# EAGLE design rpi-receiver (EAGLE 6.2)
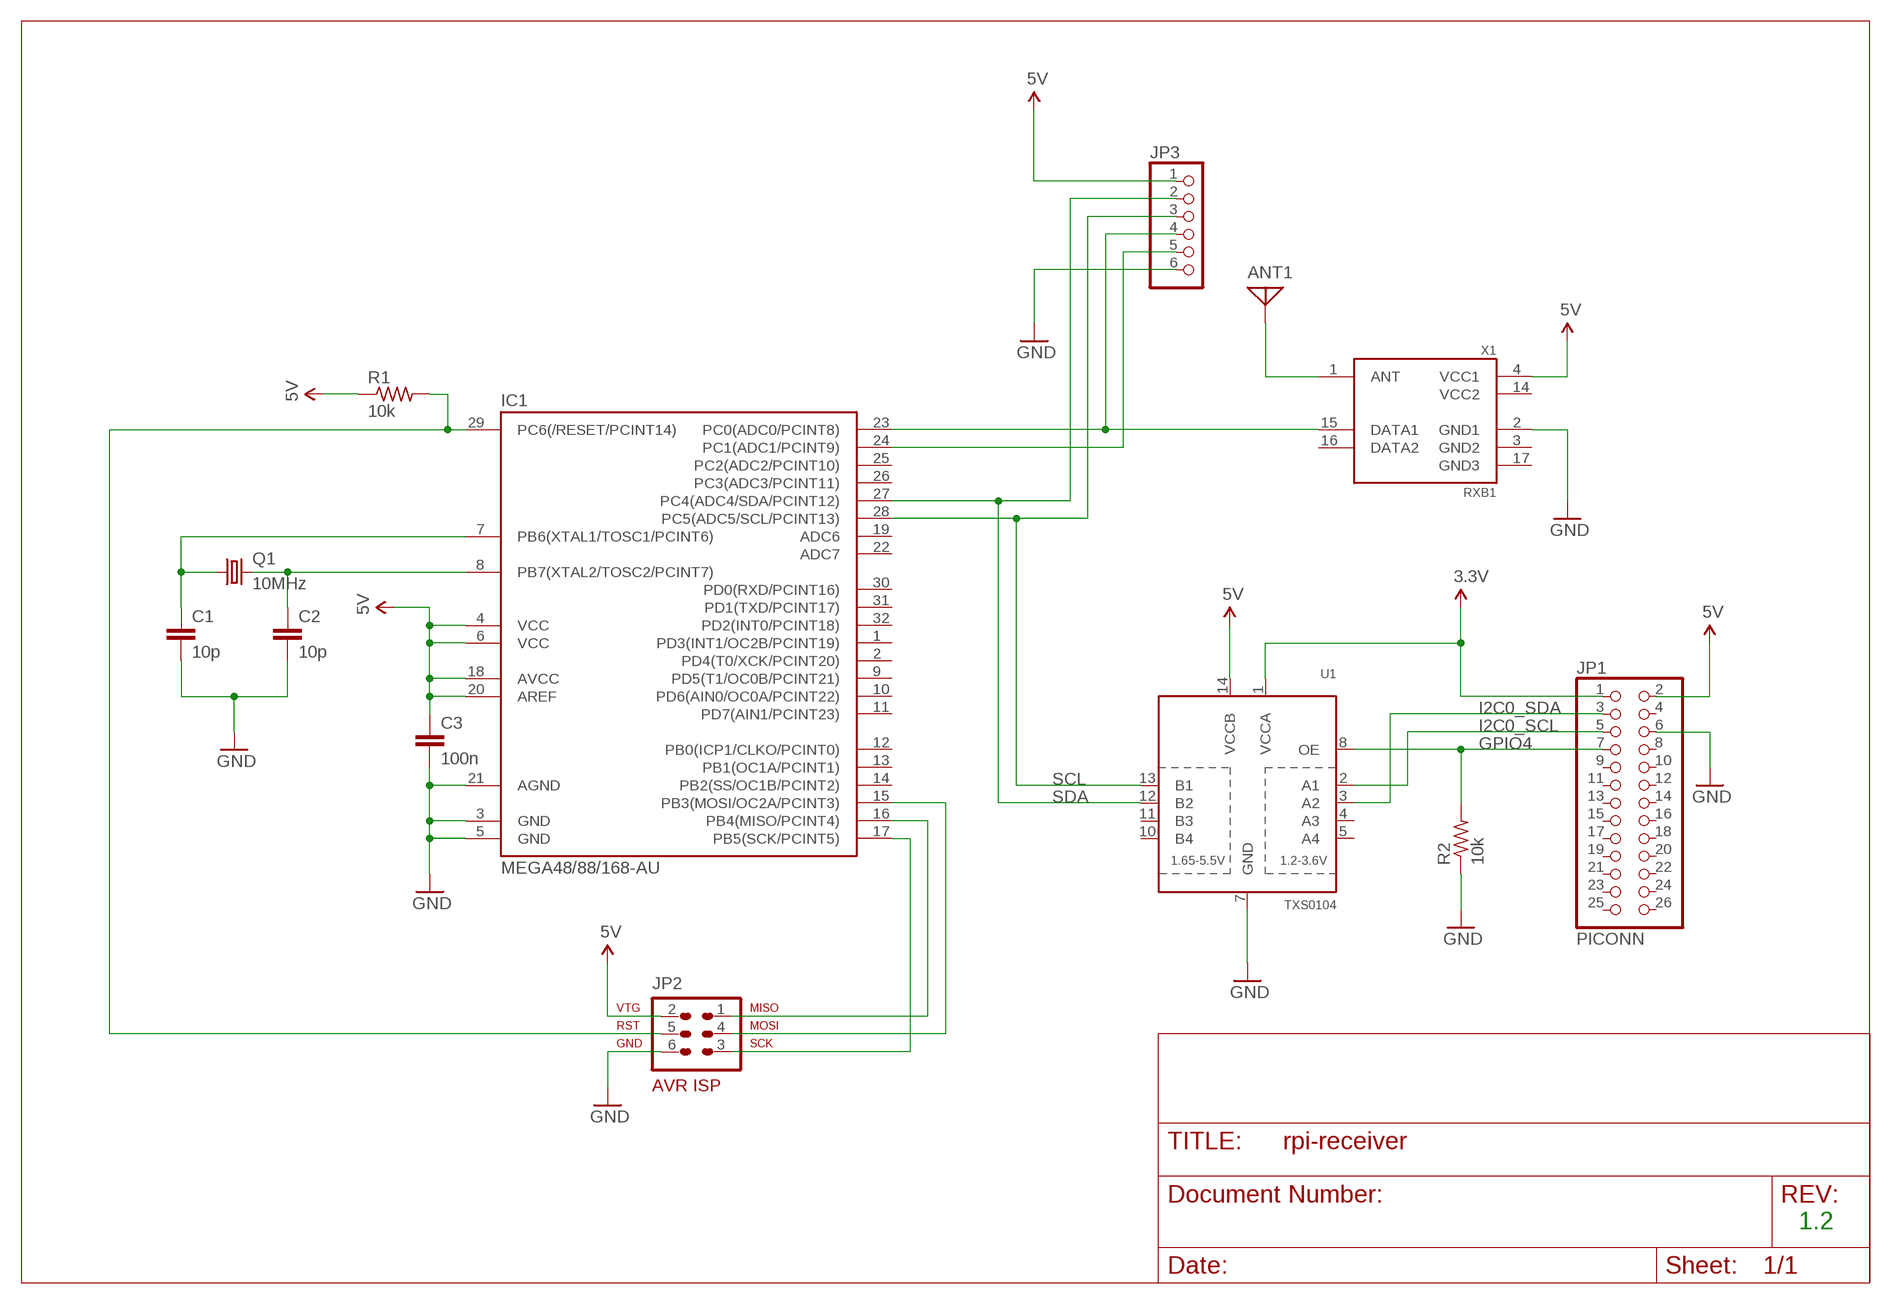
[diagram p0: schematic, sheet 1]

## Parts
ANT1  ANTENNA  [PAD-01]
C1  10p  C-EUC0805  [C0805]
C2  10p  C-EUC0805  [C0805]
C3  100n  C-EUC0805  [C0805]
IC1  MEGA48/88/168-AU  [TQFP32-08]
JP1  PICONN  PINHD-2X13  [2X13]
JP2  AVR-ISP-6POL-HDR  [22-23-2061]
JP3  PINHD-1X6  [1X06]
Q1  10MHz  CRYSTALHC49UP  [HC49UP]
R1  10k  R-US_M0805  [M0805]
R2  10k  R-US_M0805  [M0805]
U1  TXS0104  TXB0104PWR  [TSSOP14]
X1  RXB1  [RXB1]

## Nets
3.3V: JP1.1 U1.1(VCCA)
5V: C3.1 IC1.4(VCC) IC1.6(VCC) IC1.18(AVCC) IC1.20(AREF) JP1.2 JP2.2 JP3.1 R1.1 U1.14(VCCB) X1.4(VCC1)
GND: C1.2 C2.2 C3.2 IC1.3(GND) IC1.5(GND) IC1.21(AGND) JP1.6 JP2.6 JP3.6 R2.1 U1.7(GND) X1.2(GND1)
GPIO4: JP1.7 R2.2 U1.8(OE)
I2C0_SCL: JP1.5 U1.2(A1)
I2C0_SDA: JP1.3 U1.3(A2)
N$1: C2.1 IC1.8(PB7(XTAL2/TOSC2/PCINT7)) Q1.2
N$2: C1.1 IC1.7(PB6(XTAL1/TOSC1/PCINT6)) Q1.1
N$3: IC1.16(PB4(MISO/PCINT4)) JP2.1
N$4: IC1.15(PB3(MOSI/OC2A/PCINT3)) JP2.4
N$6: ANT1.1 X1.1(ANT)
N$7: IC1.29(PC6(/RESET/PCINT14)) JP2.5 R1.2
N$10: IC1.17(PB5(SCK/PCINT5)) JP2.3
N$13: IC1.24(PC1(ADC1/PCINT9)) JP3.5
N$22: IC1.23(PC0(ADC0/PCINT8)) JP3.4 X1.15(DATA1)
SCL: IC1.28(PC5(ADC5/SCL/PCINT13)) JP3.3 U1.13(B1)
SDA: IC1.27(PC4(ADC4/SDA/PCINT12)) JP3.2 U1.12(B2)
Unconnected: IC1.1(PD3(INT1/OC2B/PCINT19)) IC1.2(PD4(T0/XCK/PCINT20)) IC1.9(PD5(T1/OC0B/PCINT21)) IC1.10(PD6(AIN0/OC0A/PCINT22)) IC1.11(PD7(AIN1/PCINT23)) IC1.12(PB0(ICP1/CLKO/PCINT0)) IC1.13(PB1(OC1A/PCINT1)) IC1.14(PB2(SS/OC1B/PCINT2)) IC1.19(ADC6) IC1.22(ADC7) IC1.25(PC2(ADC2/PCINT10)) IC1.26(PC3(ADC3/PCINT11)) IC1.30(PD0(RXD/PCINT16)) IC1.31(PD1(TXD/PCINT17)) IC1.32(PD2(INT0/PCINT18)) JP1.4 JP1.8 JP1.9 JP1.10 JP1.11 JP1.12 JP1.13 JP1.14 JP1.15 JP1.16 JP1.17 JP1.18 JP1.19 JP1.20 JP1.21 JP1.22 JP1.23 JP1.24 JP1.25 JP1.26 U1.4(A3) U1.5(A4) U1.10(B4) U1.11(B3) X1.16(DATA2)

## Notes on the sheet
- 1.2

## Power pins joined to a net without a drawn wire
GND2: X1.3(GND2)
GND3: X1.17(GND3)
VCC2: X1.14(VCC2)

## Library data of the parts
ANT1 = discrete:ANTENNA: Antenna
C1-C3 = rcl:C-EU: CAPACITOR, European symbol
IC1 = avr-4:MEGA48/88/168
JP1 = pinhead:PINHD-2X13: PIN HEADER
JP2 = avr-4:AVR-ISP-6: AVR ISP-6 Serial Programming Header
JP3 = adafruit:PINHD-1X6: PIN HEADER
Q1 = crystal:CRYSTAL: CRYSTAL; OC_FARNELL: unknown; OC_NEWARK: unknown
R1 R2 = rcl:R-US_: RESISTOR, American symbol
U1 = adafruit:TXB0104PWR: 4-Bit Bi-Directional Level Shifter 1.2V-3.6V (VCCA) to 1.65V-5.5V (VCCB) bi-directional level shifter with auto direction sensing. Max data rate - VCCA 1.8V: 20Mbps (50ns), VCCA 3.3V: 100Mbps (10ns) Digikey: 296-21929-1-ND
X1 = rolfe:RXB1: RXB1 433MHz receiver; Jaycar ZW-3102

## Board
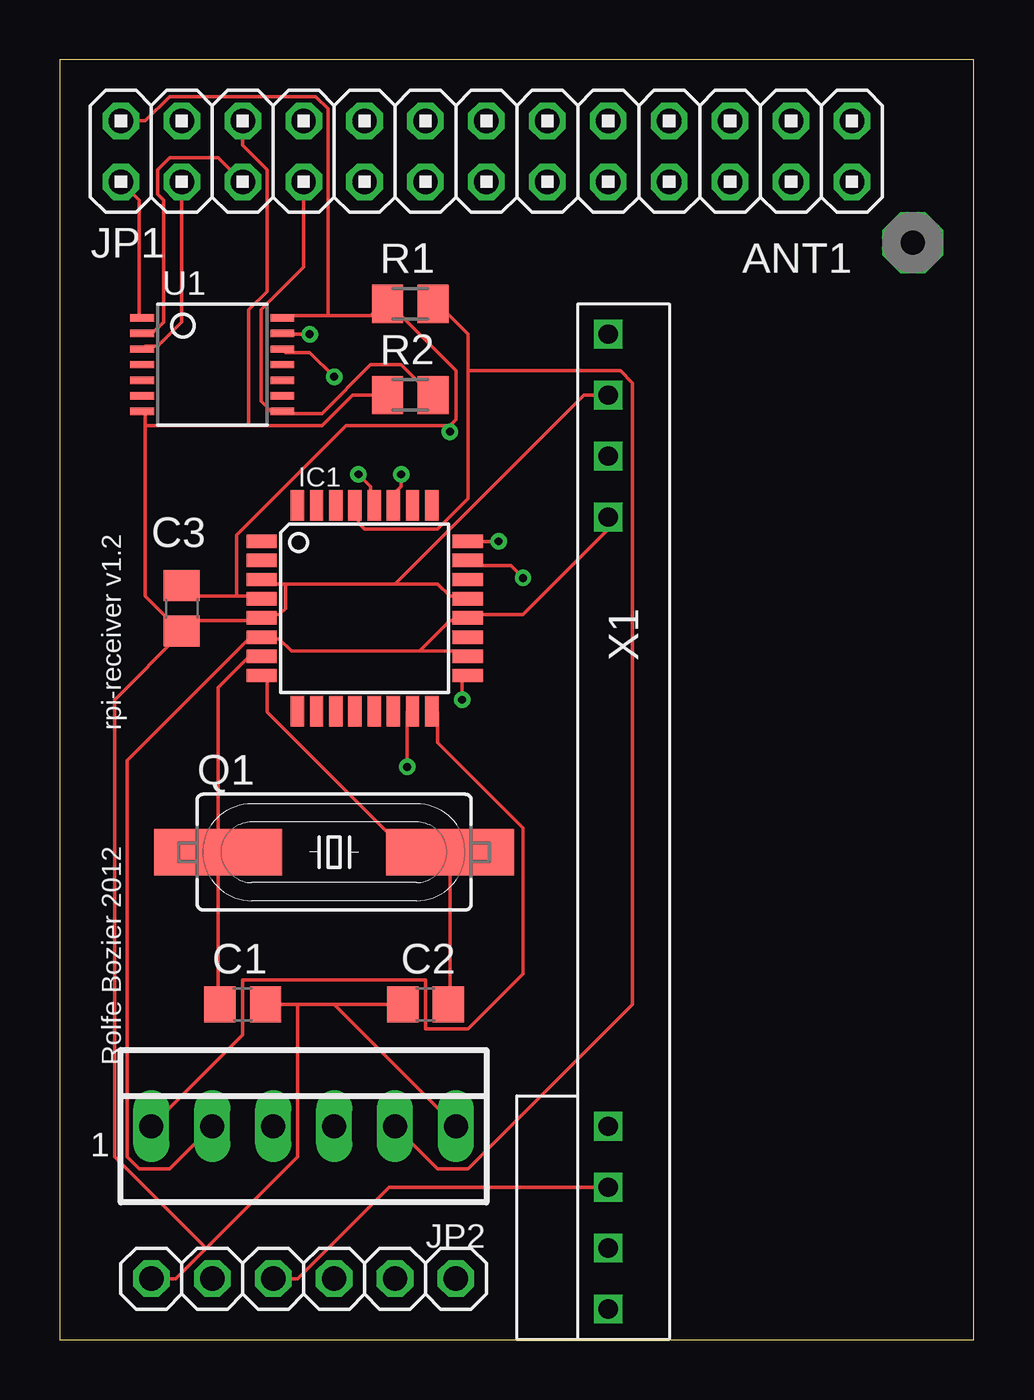
[diagram p1: board, top side]
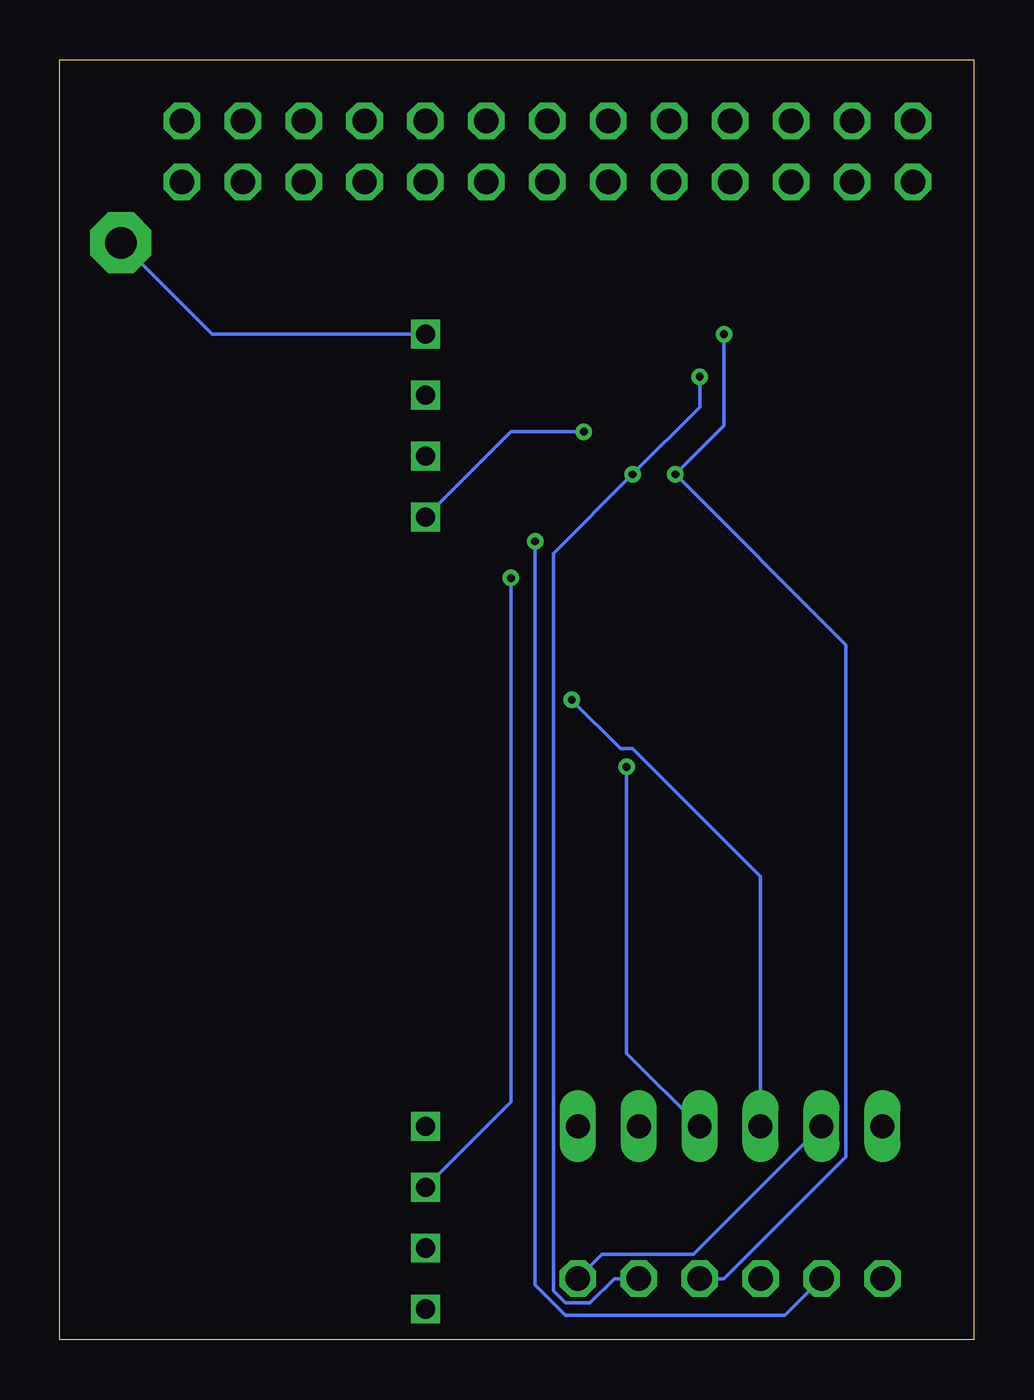
[diagram p2: board, bottom side, seen from below]

Size 38.1 x 53.34 mm. Coordinates in mm from the lower left corner, seen from the top.
Outline: 0,0 38.1,0 38.1,53.34 0,53.34 0,0
Copper layers (1*16): Top 0.0356mm / dielectric 1.5011mm / Bottom 0.0356mm
Design rules: minimum track width 6mil, minimum drill 13mil, track to track 6mil, track to pad 6mil, pad to pad 6mil, via to via 6mil, smd to smd 6mil, copper to edge 15mil, drill to drill 6mil, minimum pad ring 7mil, minimum via ring 7mil, stop-mask expansion 4mil, vias tented up to drill 0mil, thermal gap 10mil
tRestrict: area 25.4,0 to 38.1,43.2

### Footprints (pad centres in the part's own frame; a part is rotated, then mirrored left to right if it is on the bottom)
PAD-01 = drill 1.321 pad 2.54 octagon: 1 0,0
C0805 = smd 1.3 x 1.5: 1 -0.95,0; 2 0.95,0
TQFP32-08 = smd 1.27 x 0.559: 1 -4.293,2.8; 2 -4.293,2; 3 -4.293,1.2; 4 -4.293,0.4; 5 -4.293,-0.4; 6 -4.293,-1.2; 7 -4.293,-2; 8 -4.293,-2.8; 17 4.293,-2.8; 18 4.293,-2; 19 4.293,-1.2; 20 4.293,-0.4; 21 4.293,0.4; 22 4.293,1.2; 23 4.293,2; 24 4.293,2.8 | smd 0.559 x 1.27: 9 -2.8,-4.293; 10 -2,-4.293; 11 -1.2,-4.293; 12 -0.4,-4.293; 13 0.4,-4.293; 14 1.2,-4.293; 15 2,-4.293; 16 2.8,-4.293; 25 2.8,4.293; 26 2,4.293; 27 1.2,4.293; 28 0.4,4.293; 29 -0.4,4.293; 30 -1.2,4.293; 31 -2,4.293; 32 -2.8,4.293
2X13 = drill 1.016 octagon: 1 -15.24,-1.27; 2 -15.24,1.27; 3 -12.7,-1.27; 4 -12.7,1.27; 5 -10.16,-1.27; 6 -10.16,1.27; 7 -7.62,-1.27; 8 -7.62,1.27; 9 -5.08,-1.27; 10 -5.08,1.27; 11 -2.54,-1.27; 12 -2.54,1.27; 13 0,-1.27; 14 0,1.27; 15 2.54,-1.27; 16 2.54,1.27; 17 5.08,-1.27; 18 5.08,1.27; 19 7.62,-1.27; 20 7.62,1.27; 21 10.16,-1.27; 22 10.16,1.27; 23 12.7,-1.27; 24 12.7,1.27; 25 15.24,-1.27; 26 15.24,1.27
22-23-2061 = drill 1 long: 1 -6.35,0; 2 -3.81,0; 3 -1.27,0; 4 1.27,0; 5 3.81,0; 6 6.35,0
1X06 = drill 1.016 octagon: 1 -6.35,0; 2 -3.81,0; 3 -1.27,0; 4 1.27,0; 5 3.81,0; 6 6.35,0
HC49UP = smd 5.334 x 1.93: 1 -4.826,0; 2 4.826,0
M0805 = smd 1.3 x 1.6: 1 -0.95,0; 2 0.95,0
TSSOP14 = smd 0.305 x 0.991: 1 -1.95,-2.918; 2 -1.3,-2.918; 3 -0.65,-2.918; 4 0,-2.918; 5 0.65,-2.918; 6 1.3,-2.918; 7 1.95,-2.918; 8 1.95,2.918; 9 1.3,2.918; 10 0.65,2.918; 11 0,2.918; 12 -0.65,2.918; 13 -1.3,2.918; 14 -1.95,2.918
RXB1 = drill 0.8 square: 1 -20.32,0; 2 -17.78,0; 3 -15.24,0; 4 -12.7,0; 14 12.7,0; 15 15.24,0; 16 17.78,0; 17 20.32,0

### Placement (x,y rotation side)
ANT1  35.56,45.72 180 top
C1  7.62,13.97 0 top
C2  15.24,13.97 180 top
C3  5.08,30.48 270 top
IC1  12.7,30.48 0 top
JP1  17.78,49.53 0 top
JP2  10.16,8.89 0 top
JP3  10.16,2.54 180 top
Q1  11.43,20.32 0 top
R1  14.61,43.18 0 top
R2  14.61,39.37 0 top
U1  6.35,40.64 270 top
X1  22.86,21.59 270 top

### Tracks (layer width: path | path; a pad name or v marks a point on that pad's centre or on a via)
3.3V
  Top 0.152: JP1.1 3.3,47.5 3.3,42.67 U1.1
5V  (via drill 0.33)
  Top 0.152: 7.37,30.99 5.33,30.99 5.08,31.24 C3.1 | 7.37,30.99 8.38,30.99 IC1.4 | 11.18,42.67 12.95,42.67 13.46,43.18 R1.1 13.72,43.18 16.51,40.39 16.51,38.35 16.26,38.1 | 11.18,42.67 9.4,42.67 U1.14 | 7.37,30.99 7.37,33.53 11.94,38.1 16.26,38.1 | JP1.2 3.56,50.8 4.57,51.82 10.67,51.82 11.18,51.31 11.18,42.67 | 14.99,28.7 9.65,28.7 9.14,29.21 8.64,29.21 IC1.6 8.38,29.21 7.87,29.21 2.79,24.13 2.79,7.62 3.3,7.11 4.57,7.11 JP2.2 | 14.99,28.7 16.76,28.7 IC1.18 | 14.99,28.7 16.26,29.97 16.76,29.97 IC1.20 17.02,30.23 19.3,30.23 22.86,33.78 X1.4 | v16.26,37.85 16.26,38.1
  Bottom 0.152: JP2.2 11.68,3.56 15.49,3.56 JP3.1 | v16.26,37.85 19.3,37.85 X1.4
GND
  Top 0.152: C2.2 11.43,13.97 | 11.43,13.97 9.91,13.97 | 9.91,13.97 C1.2 | 11.43,13.97 JP2.6 | JP3.6 4.83,2.54 6.1,3.81 | 6.1,3.81 9.91,7.62 9.91,13.97 | 13.97,31.5 15.75,31.5 16.26,30.99 16.76,30.99 IC1.21 | 13.97,31.5 9.4,31.5 | 9.4,31.5 8.64,31.5 IC1.3 | X1.2 21.84,39.37 13.97,31.5 | 3.56,38.1 3.56,30.99 4.57,29.97 | 3.56,38.1 3.56,38.61 U1.7 | 5.08,29.46 4.57,29.97 | 4.57,29.97 8.38,29.97 IC1.5 8.64,30.23 9.14,30.23 9.4,30.48 9.4,31.5 | 4.57,29.97 C3.2 5.08,29.46 | R2.1 12.19,39.37 10.92,38.1 7.87,38.1 | 3.56,38.1 7.87,38.1 | JP1.6 7.62,49.78 8.64,48.77 8.64,43.69 7.87,42.93 7.87,38.1 | 6.1,3.81 2.29,7.62 2.29,26.67 5.08,29.46
GPIO4
  Top 0.152: R2.2 15.49,39.37 14.22,40.64 12.95,40.64 10.92,38.61 9.4,38.61 U1.8 9.14,38.61 8.89,38.61 8.38,39.12 8.38,42.93 10.16,44.7 JP1.7
I2C0_SCL
  Top 0.152: JP1.5 6.6,49.28 4.57,49.28 4.06,48.77 4.06,47.75 4.32,47.5 4.32,42.42 3.81,41.91 3.56,41.91 U1.2
I2C0_SDA
  Top 0.152: JP1.3 5.08,42.42 4.06,41.4 3.56,41.4 U1.3
N$1
  Top 0.152: IC1.8 8.64,27.43 8.64,26.16 14.48,20.32 Q1.2 16.26,13.97 C2.1
N$2
  Top 0.152: IC1.7 8.38,28.45 7.87,28.45 6.6,27.18 Q1.1 6.6,13.97 C1.1
N$3
  Top 0.152: JP2.1 7.62,12.7 7.62,14.99 15.24,14.99 15.24,12.95 17.02,12.95 19.3,15.24 19.3,21.34 15.75,24.89 15.75,26.16 IC1.16
N$4  (via drill 0.33)
  Top 0.152: v14.48,23.88 14.48,26.16 IC1.15
  Bottom 0.152: v14.48,23.88 14.48,11.94 JP2.4
N$6
  Bottom 0.152: X1.1 31.75,41.91 ANT1.1
N$7
  Top 0.152: 17.02,40.39 17.02,41.91 15.75,43.18 R1.2 | 17.02,40.39 17.02,35.05 15.75,33.78 12.7,33.78 12.45,34.04 12.45,34.54 IC1.29 | JP2.5 15.75,7.11 17.02,7.11 23.88,13.97 23.88,39.88 23.37,40.39 17.02,40.39
N$10  (via drill 0.33)
  Top 0.152: v16.76,26.67 16.76,27.43 IC1.17
  Bottom 0.152: v16.76,26.67 14.73,24.64 14.22,24.64 8.89,19.3 JP2.3
N$13  (via drill 0.33)
  Top 0.152: v18.29,33.27 17.02,33.27 IC1.24
  Bottom 0.152: v18.29,33.27 18.29,2.29 17.02,1.02 7.87,1.02 JP3.5
N$22  (via drill 0.33)
  Top 0.152: v19.3,31.75 18.8,32.26 17.02,32.26 IC1.23 | JP3.4 9.91,2.54 13.72,6.35 X1.15
  Bottom 0.152: v19.3,31.75 19.3,9.91 X1.15
SCL  (via drill 0.33)
  Top 0.152: v10.41,41.91 9.4,41.91 U1.13 | v12.45,36.07 12.95,35.56 12.95,34.8 IC1.28
  Bottom 0.152: v10.41,41.91 10.41,38.1 v12.45,36.07 5.33,28.96 5.33,7.62 10.41,2.54 JP3.3
SDA  (via drill 0.33)
  Top 0.152: v11.43,40.13 10.41,41.15 9.4,41.15 U1.12 | v14.22,36.07 14.22,35.56 13.97,35.31 13.97,34.8 IC1.27
  Bottom 0.152: v11.43,40.13 11.43,38.86 v14.22,36.07 17.53,32.77 17.53,2.03 17.02,1.52 16,1.52 14.99,2.54 JP3.2

### Text on the board
tNames: rpi-receiver v1.2 | Rolfe Bozier 2012 | 1